# EAGLE design Radio Board (EAGLE 9.6.2)
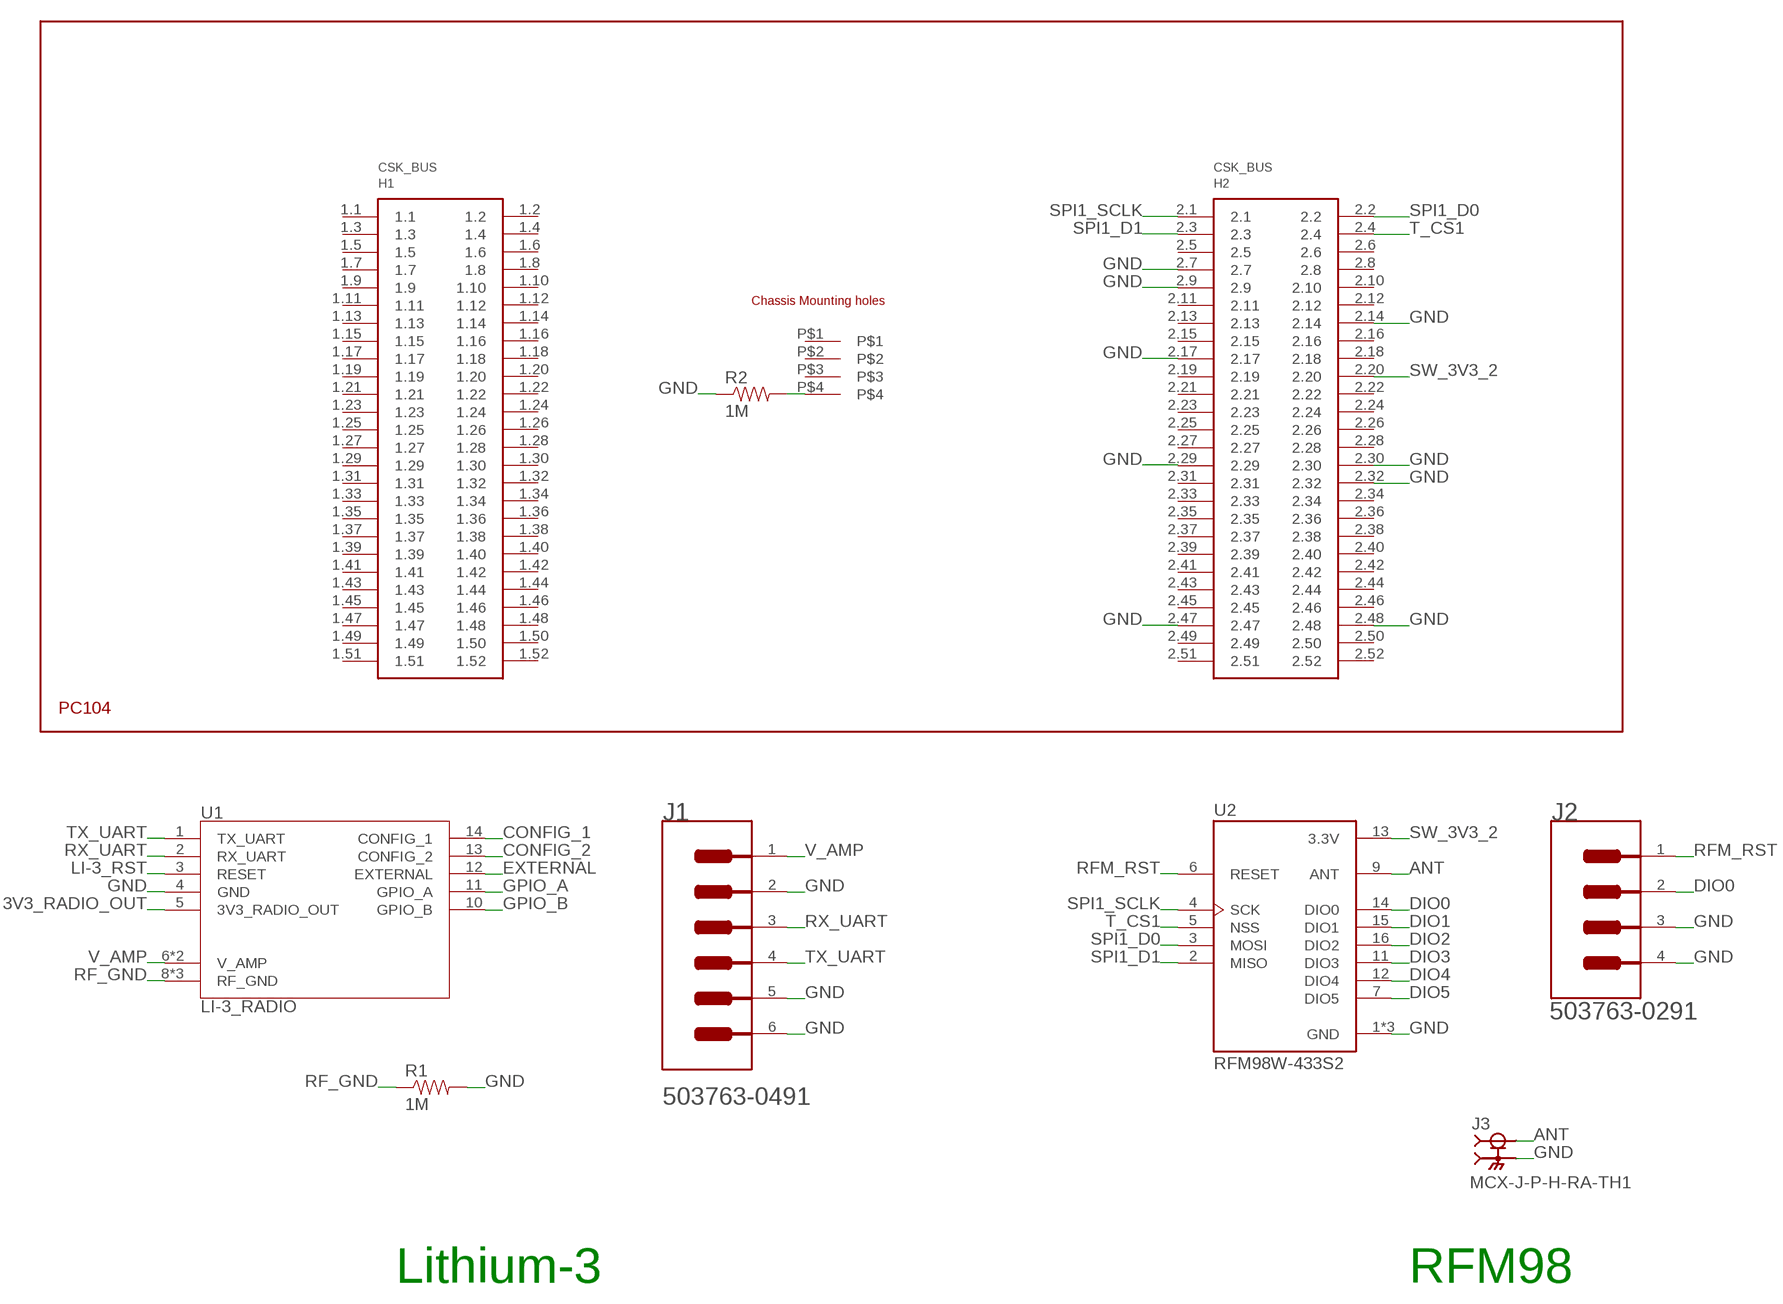
[diagram p0: schematic, sheet 1]

## Parts
H1  PC104_WCONN  [PC104_WCONN]
J1  MOLEX_503763-0491MOLEX_503763-0491_0_0  [MOLEX_503763-0491_0]
J2  MOLEX_503763-0291MOLEX_503763-0291_0_0  [MOLEX_503763-0291_0]
J3  MCX-J-P-H-RA-TH1  [SAMTEC_MCX-J-P-H-RA-TH1]
R1  1M  RESISTOR0805-RES  [0805]
R2  1M  RESISTOR0805-RES  [0805]
U1  LI-3_RADIO  [LI-3_RADIO]
U2  RFM98W-433S2  [RFM98W-433S2]

## Nets
3V3_RADIO_OUT: U1.5(3V3_RADIO_OUT)
ANT: J3.1 U2.9(ANT)
CONFIG_1: U1.14(CONFIG_1)
CONFIG_2: U1.13(CONFIG_2)
DIO0: J2.2 U2.14(DIO0)
DIO1: U2.15(DIO1)
DIO2: U2.16(DIO2)
DIO3: U2.11(DIO3)
DIO4: U2.12(DIO4)
DIO5: U2.7(DIO5)
EXTERNAL: U1.12(EXTERNAL)
GND: H1.2.7 H1.2.9 H1.2.14 H1.2.17 H1.2.29 H1.2.30 H1.2.32 H1.2.47 H1.2.48 J1.2 J1.5(MNT_1) J1.6(MNT_2) J2.3(MNT_1) J2.4(MNT_2) J3.S1 J3.S2 J3.S3 J3.S4 R1.2 R2.1 U1.4(GND) U2.1(GND) U2.8(GND) U2.10(GND)
GPIO_A: U1.11(GPIO_A)
GPIO_B: U1.10(GPIO_B)
LI-3_RST: U1.3(RESET)
N$1: H1.P$4 R2.2
RF_GND: R1.1 U1.8(RF_GND) U1.9(RF_GND) U1.15(RF_GND)
RFM_RST: J2.1 U2.6(RESET)
RX_UART: J1.3 U1.2(RX_UART)
SPI1_D0: H1.2.2 U2.3(MOSI)
SPI1_D1: H1.2.3 U2.2(MISO)
SPI1_SCLK: H1.2.1 U2.4(SCK)
SW_3V3_2: H1.2.20 U2.13(3.3V)
T_CS1: H1.2.4 U2.5(NSS)
TX_UART: J1.4 U1.1(TX_UART)
V_AMP: J1.1 U1.6(V_AMP) U1.7(V_AMP)
Unconnected: H1.1.1 H1.1.2 H1.1.3 H1.1.4 H1.1.5 H1.1.6 H1.1.7 H1.1.8 H1.1.9 H1.1.10 H1.1.11 H1.1.12 H1.1.13 H1.1.14 H1.1.15 H1.1.16 H1.1.17 H1.1.18 H1.1.19 H1.1.20 H1.1.21 H1.1.22 H1.1.23 H1.1.24 H1.1.25 H1.1.26 H1.1.27 H1.1.28 H1.1.29 H1.1.30 H1.1.31 H1.1.32 H1.1.33 H1.1.34 H1.1.35 H1.1.36 H1.1.37 H1.1.38 H1.1.39 H1.1.40 H1.1.41 H1.1.42 H1.1.43 H1.1.44 H1.1.45 H1.1.46 H1.1.47 H1.1.48 H1.1.49 H1.1.50 H1.1.51 H1.1.52 H1.2.5 H1.2.6 H1.2.8 H1.2.10 H1.2.11 H1.2.12 H1.2.13 H1.2.15 H1.2.16 H1.2.18 H1.2.19 H1.2.21 H1.2.22 H1.2.23 H1.2.24 H1.2.25 H1.2.26 H1.2.27 H1.2.28 H1.2.31 H1.2.33 H1.2.34 H1.2.35 H1.2.36 H1.2.37 H1.2.38 H1.2.39 H1.2.40 H1.2.41 H1.2.42 H1.2.43 H1.2.44 H1.2.45 H1.2.46 H1.2.49 H1.2.50 H1.2.51 H1.2.52 H1.P$1 H1.P$2 H1.P$3

## Notes on the sheet
- Lithium-3 | RFM98

## Library data of the parts
H1 = HSFL_Main_Library:PC104_WCONN
J1 = Molex - 503763-0491:MOLEX_503763-0491: Wire-To-Board Connector, Pico-Lock 503763 Series, Surface Mount, Header, 4 Contacts, 1 mm; AUTOMOTIVE: No; CENTROID_NOT_SPECIFIED: No; CONN_GENDER: Male; CONN_ORIENTATION: Right Angle; CONTACT_MATERIAL: Gold,Nickel; CURRENT_RATING: 1.5A; DATASHEET: https://www.molex.com/webdocs/datasheets/pdf/en-us/5037630491_PCB_HEADERS.pdf; DEVICE_CLASS_L1: Connectors; DEVICE_CLASS_L2: Headers and Wire Housings; DEVICE_CLASS_L3: unset; DIGIKEY_DESCRIPTION: CONN HEADER 1MM R/A 4CKT; DIGIKEY_PART_NUMBER: WM10655CT-ND; FOOTPRINT_URL: https://www.molex.com/pdm_docs/sd/5037630491_sd.pdf; FOOTPRINT_VARIANT_NAME_0: Recommended_Land_Pattern; HEIGHT: 1.7mm; LEAD_FREE: Yes; MF: Molex; MFG_PACKAGE_IDENT: 503763-0491; MFG_PACKAGE_IDENT_DATE: 0; MFG_PACKAGE_IDENT_REV: 0; MOUSER_PART_NUMBER: 538-503763-0491; MPN: 503763-0491; NUMBER_OF_CONTACTS: 4; NUMBER_OF_ROWS: 1; PACKAGE: HDR4; PITCH: 1mm; PREFIX: J; ROHS: Yes; TEMPERATURE_RANGE_HIGH: +105°C; TEMPERATURE_RANGE_LOW: -40°C; VERIFICATION_VERSION: 0.0.0.1; VOLTAGE_RATING: 150V
J2 = Molex - 503763-0291:MOLEX_503763-0291: 2 Positions Header Connector 0.039" (1.00mm) Surface Mount, Right Angle Gold; CENTROID_NOT_SPECIFIED: No; DATASHEET: http://www.molex.com/pdm_docs/sd/5037630291_sd.pdf; DIGIKEY_DESCRIPTION: CONN HEADER 1MM R/A 2CKT; DIGIKEY_PART_NUMBER: WM10654CT-ND; LEAD_FREE: yes; MF: Molex; MOUSER_PART_NUMBER: 538-503763-0291; MPN: 503763-0291; PACKAGE: HDR02; PREFIX: J; ROHS: yes; TEMPERATURE_RANGE_HIGH: +105°C; TEMPERATURE_RANGE_LOW: -40°C
J3 = MCX-J-P-H-RA-TH1:MCX-J-P-H-RA-TH1: 50 Ohm MCX Jack or Plug, Through-hole; DESCRIPTION: MCX Connector Jack, Female Socket 50Ohm Through Hole, Right Angle Solder; DIGI-KEY_PART_NUMBER: SAM10607-ND; MF: Samtec; MP: MCX-J-P-H-RA-TH1; PACKAGE: None; PURCHASE-URL: https://pricing.snapeda.com/search/part/MCX-J-P-H-RA-TH1/?ref=eda
R1 R2 = HSFL_Main_Library:RESISTOR: Resistor Basic schematic elements and footprints for 0603, 1206, and PTH resistors.
U1 = Lithium-3 Radio:LI-3_RADIO
U2 = RFM98:RFM98W-433S2: RFM98W LoRa Transceiver Module 433MHz Check availability <https://pricing.snapeda.com/parts/RFM98W-433S2/RF%20Solutions/view-part?ref=eda>; AVAILABILITY: In Stock; DESCRIPTION: 802.15.4, General ISM < 1GHz LoRa™ Transceiver Module 433MHz - Surface Mount; MF: RF Solutions; MP: RFM98W-433S2; PACKAGE: SMD-16 RF Solutions; PRICE: None; PURCHASE-URL: https://pricing.snapeda.com/search/part/RFM98W-433S2/?ref=eda

## Board
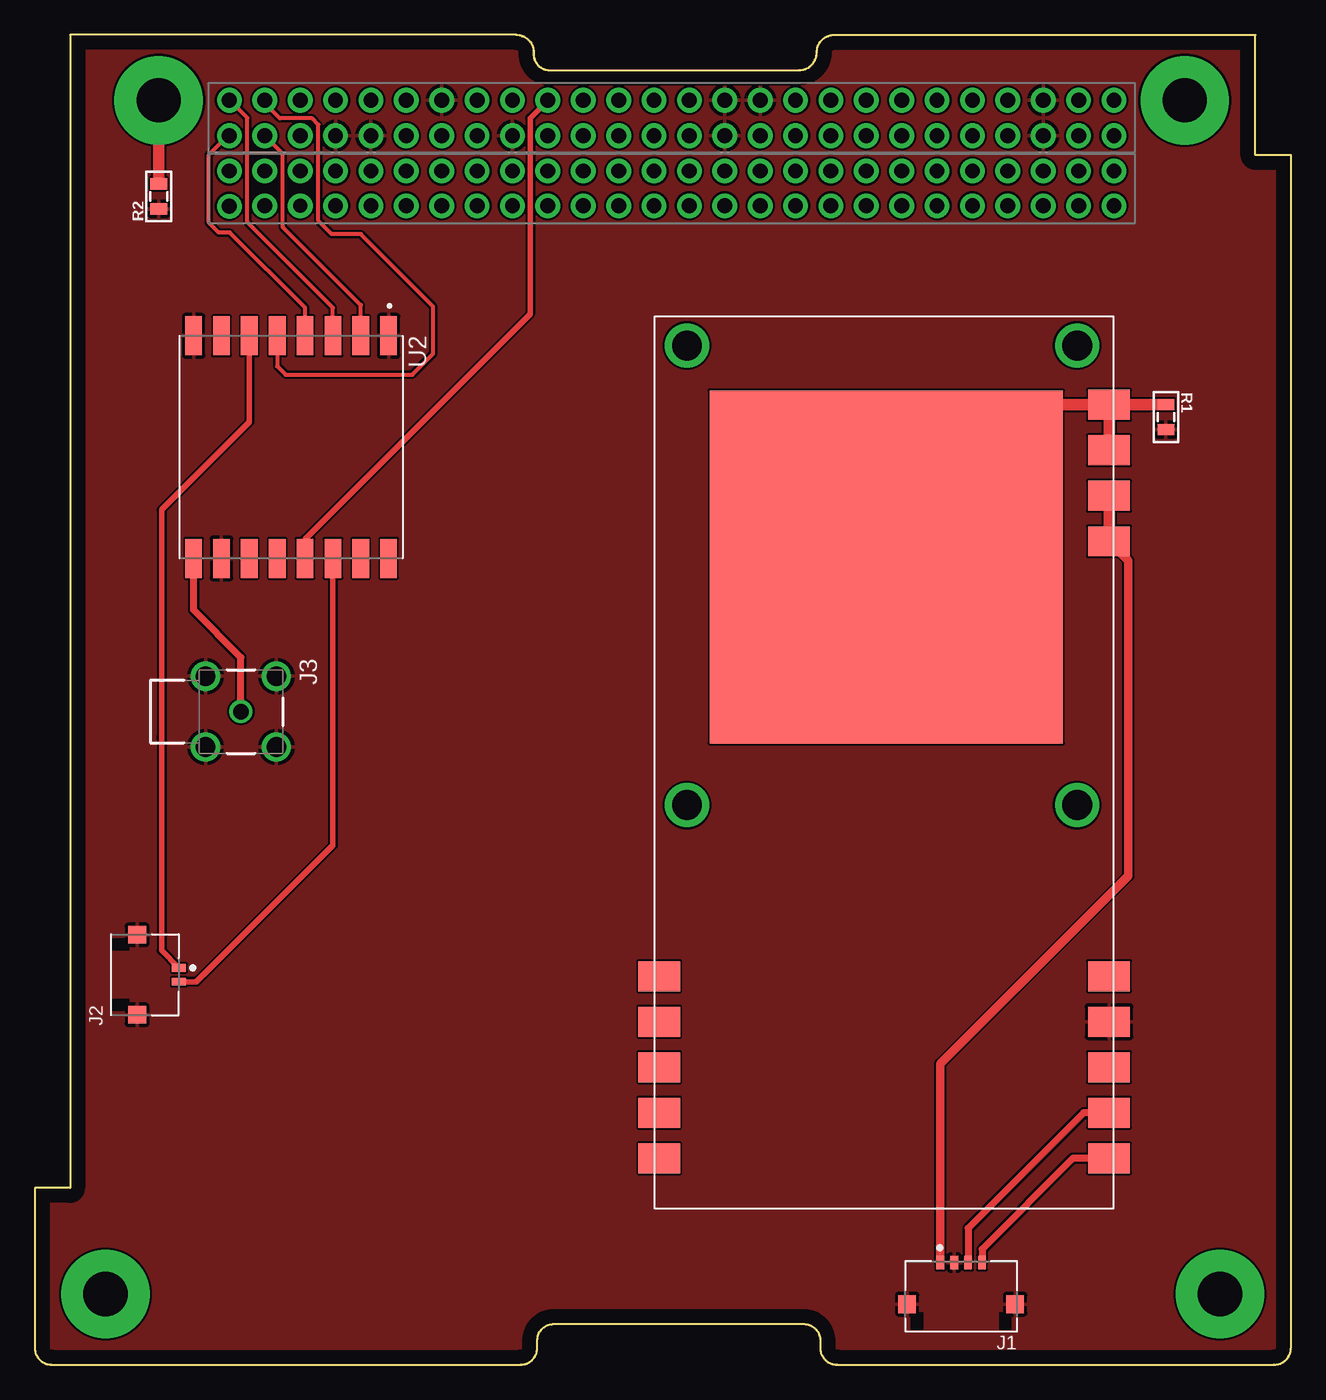
[diagram p1: board, top side]
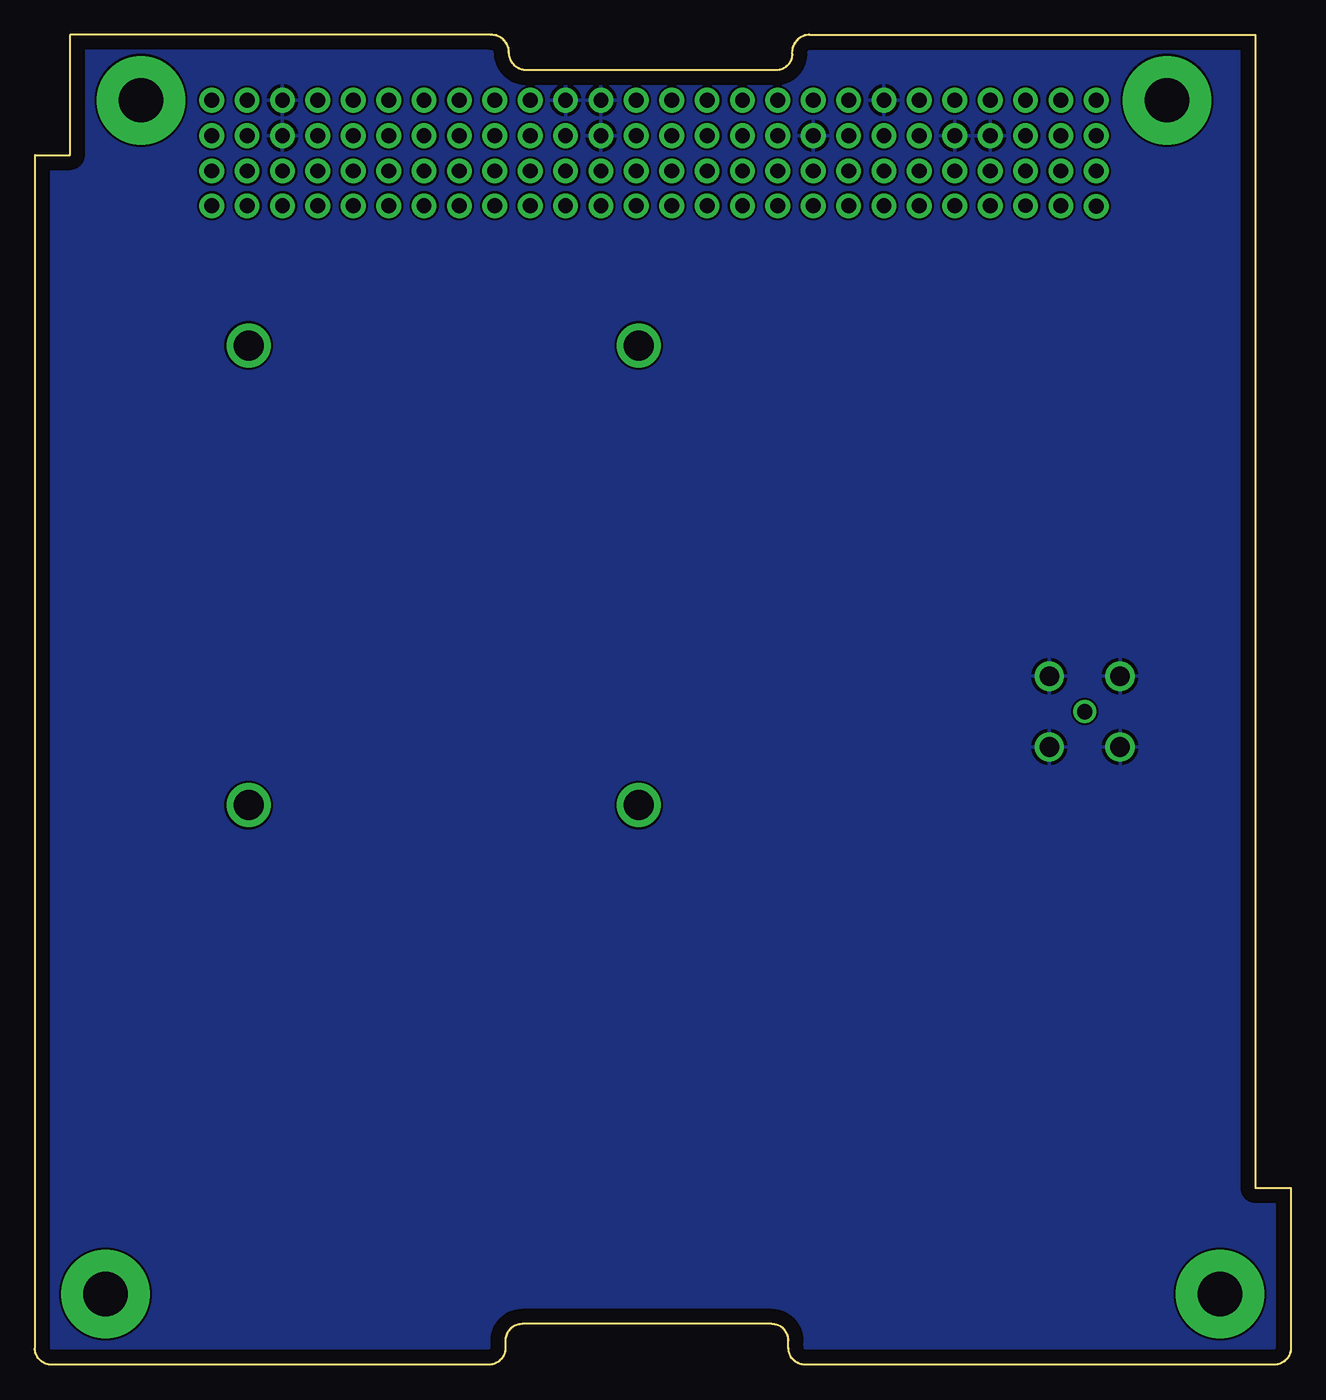
[diagram p2: board, bottom side, seen from below]

Size 90.17 x 95.5 mm. Coordinates in mm from the lower left corner, seen from the top.
Copper layers (1*16): Top 0.035mm / dielectric 1.5mm / Bottom 0.035mm
Design rules "default": minimum track width 6mil, minimum drill 0.35mm, track to track 6mil, track to pad 6mil, pad to pad 6mil, via to via 6mil, smd to smd 6mil, copper to edge 40mil, drill to drill 6mil, minimum pad ring 10mil, minimum via ring 8mil, stop-mask expansion 4mil, vias tented up to drill 0mil, thermal gap 10mil

### Footprints (pad centres in the part's own frame; a part is rotated, then mirrored left to right if it is on the bottom)
PC104_WCONN = drill 1.067 pad 1.778: 1.1 13.97,83.185; 1.2 13.97,85.725; 1.3 16.51,83.223; 1.4 16.51,85.725; 1.6 19.05,85.725; 1.7 21.59,83.223; 1.8 21.59,85.725; 1.9 24.13,83.223; 1.10 24.13,85.725; 1.11 26.67,83.223; 1.12 26.67,85.725; 1.13 29.21,83.223; 1.14 29.21,85.725; 1.15 31.75,83.223; 1.16 31.75,85.725; 1.17 34.29,83.223; 1.18 34.29,85.725; 1.19 36.83,83.223; 1.20 36.83,85.725; 1.21 39.37,83.223; 1.22 39.37,85.725; 1.23 41.91,83.223; 1.24 41.91,85.725; 1.25 44.45,83.223; 1.26 44.45,85.725; 1.27 46.99,83.223; 1.28 46.99,85.725; 1.29 49.53,83.223; 1.30 49.53,85.725; 1.31 52.07,83.223; 1.32 52.07,85.725; 1.33 54.61,83.223; 1.34 54.61,85.725; 1.35 57.15,83.223; 1.36 57.15,85.725; 1.37 59.69,83.223; 1.38 59.69,85.725; 1.39 62.23,83.223; 1.40 62.23,85.725; 1.41 64.77,83.223; 1.42 64.77,85.725; 1.43 67.31,83.223; 1.44 67.31,85.725; 1.45 69.85,83.223; 1.46 69.85,85.725; 1.47 72.39,83.223; 1.48 72.39,85.725; 1.49 74.93,83.223; 1.50 74.93,85.725; 1.51 77.47,83.223; 1.52 77.47,85.725; 2.1 13.97,88.265; 2.2 13.97,90.805; 2.3 16.51,88.265; 2.4 16.51,90.805; 2.5 19.05,88.265; 2.6 19.05,90.805; 2.7 21.59,88.265; 2.8 21.59,90.805; 2.9 24.13,88.265; 2.10 24.13,90.805; 2.11 26.67,88.265; 2.12 26.67,90.805; 2.13 29.21,88.265; 2.14 29.21,90.805; 2.15 31.75,88.265; 2.16 31.75,90.805; 2.17 34.29,88.265; 2.18 34.29,90.805; 2.19 36.83,88.265; 2.20 36.83,90.805; 2.21 39.37,88.265; 2.22 39.37,90.805; 2.23 41.91,88.265; 2.24 41.91,90.805; 2.25 44.45,88.265; 2.26 44.45,90.805; 2.27 46.99,88.265; 2.28 46.99,90.805; 2.29 49.53,88.265; 2.30 49.53,90.805; 2.31 52.07,88.265; 2.32 52.07,90.805; 2.33 54.61,88.265; 2.34 54.61,90.805; 2.35 57.15,88.265; 2.36 57.15,90.805; 2.37 59.69,88.265; 2.38 59.69,90.805; 2.39 62.23,88.265; 2.40 62.23,90.805; 2.41 64.77,88.265; 2.42 64.77,90.805; 2.43 67.31,88.265; 2.44 67.31,90.805; 2.45 69.85,88.265; 2.46 69.85,90.805; 2.47 72.39,88.265; 2.48 72.39,90.805; 2.49 74.93,88.265; 2.50 74.93,90.805; 2.51 77.47,88.265; 2.52 77.47,90.805 | drill 1.016 pad 1.778: 1.5 19.05,83.223 | drill 3.175 pad 6.35: P$1 5.08,5.08; P$2 85.09,5.08; P$3 82.55,90.805; P$4 8.89,90.805
MOLEX_503763-0491_0 = smd 0.55 x 1: 1 1.5,-2.435; 2 0.5,-2.435; 3 -0.5,-2.435; 4 -1.5,-2.435 | smd 1.26 x 1.3: 5 -3.875,0.555; 6 3.875,0.555
MOLEX_503763-0291_0 = smd 0.55 x 1: 1 0.5,-2.435; 2 -0.5,-2.435 | smd 1.26 x 1.3: 3 -2.875,0.555; 4 2.875,0.555
SAMTEC_MCX-J-P-H-RA-TH1 = drill 1.1: 1 0,0 | drill 1.4: S1 -2.54,2.54; S2 2.54,2.54; S3 2.54,-2.54; S4 -2.54,-2.54
0805 = smd 0.8 x 1.2: 1 -0.9,0; 2 0.9,0
LI-3_RADIO = smd 3 x 2.15: 1 32.62,3.62; 2 32.62,6.89; 3 32.62,10.16; 4 32.62,13.43; 5 32.62,16.7; 6 32.62,47.93; 7 32.62,51.2; 8 32.62,54.47; 9 32.62,57.74; 10 0.32,16.7; 11 0.32,13.43; 12 0.32,10.16; 13 0.32,6.89; 14 0.32,3.62 | smd 25.35 x 25.35: 15 16.62,46.09 | drill 2.15 pad 2.8: P$1 2.32,61.99; P$2 30.32,61.99; P$3 2.32,28.99; P$4 30.32,28.99
RFM98W-433S2 = smd 2.8 x 1.2: 1 -8,7; 2 -8,5; 3 -8,3; 4 -8,1; 5 -8,-1; 6 -8,-3; 7 -8,-5; 8 -8,-7; 9 8,-7; 10 8,-5; 11 8,-3; 12 8,-1; 13 8,1; 14 8,3; 15 8,5; 16 8,7

### Placement (x,y rotation side)
H1  0,0 0 top
J1  66.5,4.9 180 top
J2  7.9,28 90 top
J3  14.8,46.9 270 top
R1  81.2,68.05 270 top
R2  8.9,83.9 90 top
U1  44.5,11.2 0 top
U2  18.4,65.9 270 top

### Tracks (layer width: path | path; a pad name or v marks a point on that pad's centre or on a via)
ANT
  Top 0.508: J3.1 14.8,50.8 11.4,54.2 U2.9
DIO0
  Top 0.406: U2.14 21.4,37.3 11.6,27.5 J2.2
GND
  pour Top: -0.2,-0.2 -0.2,95.8 2.5,95.8 90.4,95.8 90.4,80.4 90.4,-0.2
  pour Bottom: -0.4,-0.4 -0.4,96 90.6,96 90.6,-0.4
N$1
  Top 0.813: H1.P$4 R2.2
RF_GND
  Top 0.813: U1.15 72.77,68.94 U1.9 | U1.9 U1.8 | U1.9 R1.1
RFM_RST
  Top 0.406: U2.6 15.4,67.7 9.1,61.4 9.1,45.1 9.1,45 9.1,29.73 J2.1
RX_UART
  Top 0.508: U1.2 75.29,18.09 67,9.8 J1.3
SPI1_D0
  Top 0.305: U2.3 21.4,75.9 15.25,82.05 15.25,89.55 13.99,90.81 H1.2.2
SPI1_D1
  Top 0.305: U2.2 23.4,76.1 17.8,81.7 17.8,86.97 H1.2.3
SPI1_SCLK
  Top 0.305: H1.2.1 13.87,88.27 12.5,86.9 12.5,82 13.2,81.3 14,81.3 19.4,75.9 U2.4
SW_3V3_2
  Top 0.406: H1.2.20 35.55,89.53 35.55,75.45 19.4,59.3 U2.13
T_CS1
  Top 0.305: U2.5 17.4,71.7 18,71.1 27.1,71.1 28.6,72.6 28.6,76 23.4,81.2 21.3,81.2 20.35,82.15 20.35,89.05 19.9,89.5 17.6,89.5 16.51,90.59 H1.2.4
TX_UART
  Top 0.508: U1.1 74.52,14.82 68,8.3 J1.4
V_AMP
  Top 0.61: U1.6 78.5,57.75 78.5,35.1 65,21.6 J1.1
  Top 0.813: U1.7 U1.6